# EAGLE design Messgeraet (EAGLE 6.2)
Widerstandsnetzwerk für Messgerät
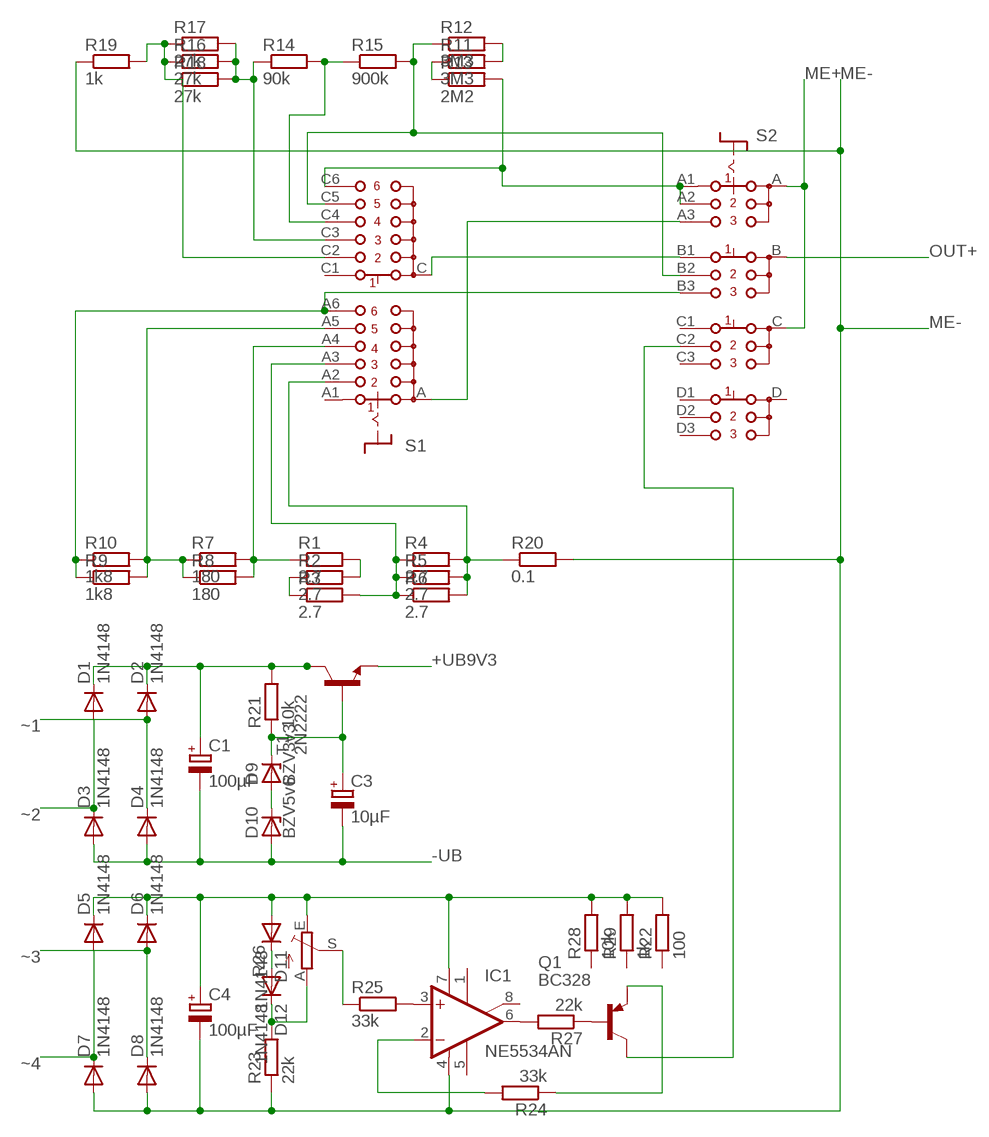
[diagram p0: schematic, sheet 1]

## Parts
C1  100µF  CPOL-EUE5-10.5  [E5-10,5]
C3  10µF  CPOL-EUE5-10.5  [E5-10,5]
C4  100µF  CPOL-EUE5-10.5  [E5-10,5]
D1  1N4148  1N4148DO35-7  [DO35-7]
D2  1N4148  1N4148DO35-7  [DO35-7]
D3  1N4148  1N4148DO35-7  [DO35-7]
D4  1N4148  1N4148DO35-7  [DO35-7]
D5  1N4148  1N4148DO35-7  [DO35-7]
D6  1N4148  1N4148DO35-7  [DO35-7]
D7  1N4148  1N4148DO35-7  [DO35-7]
D8  1N4148  1N4148DO35-7  [DO35-7]
D9  BZV3v3  BZV10  [DO34Z7]
D10  BZV5v6  BZV10  [DO34Z7]
D11  1N4148  1N4148DO35-7  [DO35-7]
D12  1N4148  1N4148DO35-7  [DO35-7]
IC1  NE5534AN  [DIL08]
Q1  BC328  [TO92-EBC]
R1  2.7  R-EU_0617/17  [0617/17]
R2  2.7  R-EU_0617/17  [0617/17]
R3  2.7  R-EU_0617/17  [0617/17]
R4  2.7  R-EU_0617/17  [0617/17]
R5  2.7  R-EU_0617/17  [0617/17]
R6  2.7  R-EU_0617/17  [0617/17]
R7  180  R-EU_0309/12  [0309/12]
R8  180  R-EU_0309/12  [0309/12]
R9  1k8  R-EU_0309/10  [0309/10]
R10  1k8  R-EU_0309/10  [0309/10]
R11  3M3  R-EU_0309/12  [0309/12]
R12  3M3  R-EU_0309/12  [0309/12]
R13  2M2  R-EU_0411/15  [0411/15]
R14  90k  R-EU_0411/15  [0411/15]
R15  900k  R-EU_0309/V  [0309V]
R16  27k  R-EU_0309/12  [0309/12]
R17  27k  R-EU_0309/12  [0309/12]
R18  27k  R-EU_0309/12  [0309/12]
R19  1k  R-EU_0309/10  [0309/10]
R20  0.1  R-EU_VTA52  [VTA52]
R21  10k  R-EU_0309/10  [0309/10]
R22  100  R-EU_0309/10  [0309/10]
R23  22k  R-EU_0309/10  [0309/10]
R24  33k  R-EU_0309/10  [0309/10]
R25  33k  R-EU_0309/10  [0309/10]
R26  TRIM_EU-RJ9W  [RJ9W]
R27  22k  R-EU_0309/10  [0309/10]
R28  10k  R-EU_0309/10  [0309/10]
R29  1k  R-EU_0309/10  [0309/10]
S1  CK102X06  [CK102X06]
S2  CK104X03  [CK104X03]
T1  2N2222  [TO18]

## Nets
+UB9V3: T1.1(E)
-UB: C1.- C3.- D3.A D4.A D10.A
ME+: S2.A S2.C
ME-: C4.- D7.A D8.A IC1.4(V-) R19.1 R20.2 R23.1
N$1: R7.1 R8.1 R9.2 R10.2 S1.A5
N$2: S1.A S2.A3
N$3: R1.1 R7.2 R8.2 S1.A4
N$4: R9.1 R10.1 S1.A6 S2.B3
N$5: R1.2 R2.2
N$6: R2.1 R3.1
N$7: R3.2 R4.1 R5.1 R6.1 S1.A3
N$8: R4.2 R5.2 R6.2 R20.1 S1.A2
N$9: R14.1 R16.2 R17.2 R18.2 S1.C3
N$10: R16.1 R17.1 R18.1 R19.2 S1.C2
N$11: D12.C R23.2 R26.A
N$12: R14.2 R15.1 S1.C4
N$13: R12.1 R15.2 S1.C5 S2.B2
N$14: R11.2 R12.2
N$15: R11.1 R13.1
N$16: R13.2 S1.C6 S2.A1 S2.A2
N$17: S1.C S2.B1
N$18: Q1.C S2.C2
N$19: IC1.6(OUT) R27.2
N$20: C1.+ D1.C D2.C R21.2 T1.3(C)
N$21: Q1.B R27.1
N$22: D11.C D12.A
N$23: Q1.E R24.1
N$25: C4.+ D5.C D6.C D11.A IC1.7(V+) R22.2 R26.E R28.2 R29.2
N$26: R25.1 R26.S
N$27: D9.A D10.C
N$28: C3.+ D9.C R21.1 T1.2(B)
N$29: IC1.2(-IN) R24.2
N$30: IC1.3(+IN) R25.2
OUT+: S2.B
~1: D2.A D4.C
~2: D1.A D3.C
~3: D6.A D8.C
~4: D5.A D7.C
Unconnected: IC1.1(ON) IC1.5(CMP) IC1.8(ON/CMP) R22.1 R28.1 R29.1 S1.A1 S1.C1 S2.C1 S2.C3 S2.D S2.D1 S2.D2 S2.D3

## Library data of the parts
C1 C3 C4 = rcl:CPOL-EU: POLARIZED CAPACITOR, European symbol
D1-D8 D11 D12 = diode:1N4148: DIODE high speed (Philips)
D9 D10 = diode:BZV10: Z DIODE
IC1 = linear:NE5534: LOW-NOISE OPERATIONAL AMPLIFIER Source: http://focus.ti.com/lit/ds/symlink/ne5534.pdf
Q1 = transistor-pnp:BC328*: PNP Transistror
R1-R19 R21-R25 R27-R29 = resistor:R-EU_: RESISTOR, European symbol
R20 = rcl:R-EU_: RESISTOR, European symbol
R26 = pot:TRIM_EU-: POTENTIOMETER
S1 = switch:CK102X06: ROTARY SWITCH C&K
S2 = switch:CK104X03: ROTARY SWITCH C&K
T1 = transistor:2N2222: NPN TRANSISTOR

## Board
Widerstandsnetzwerk für Messgerät
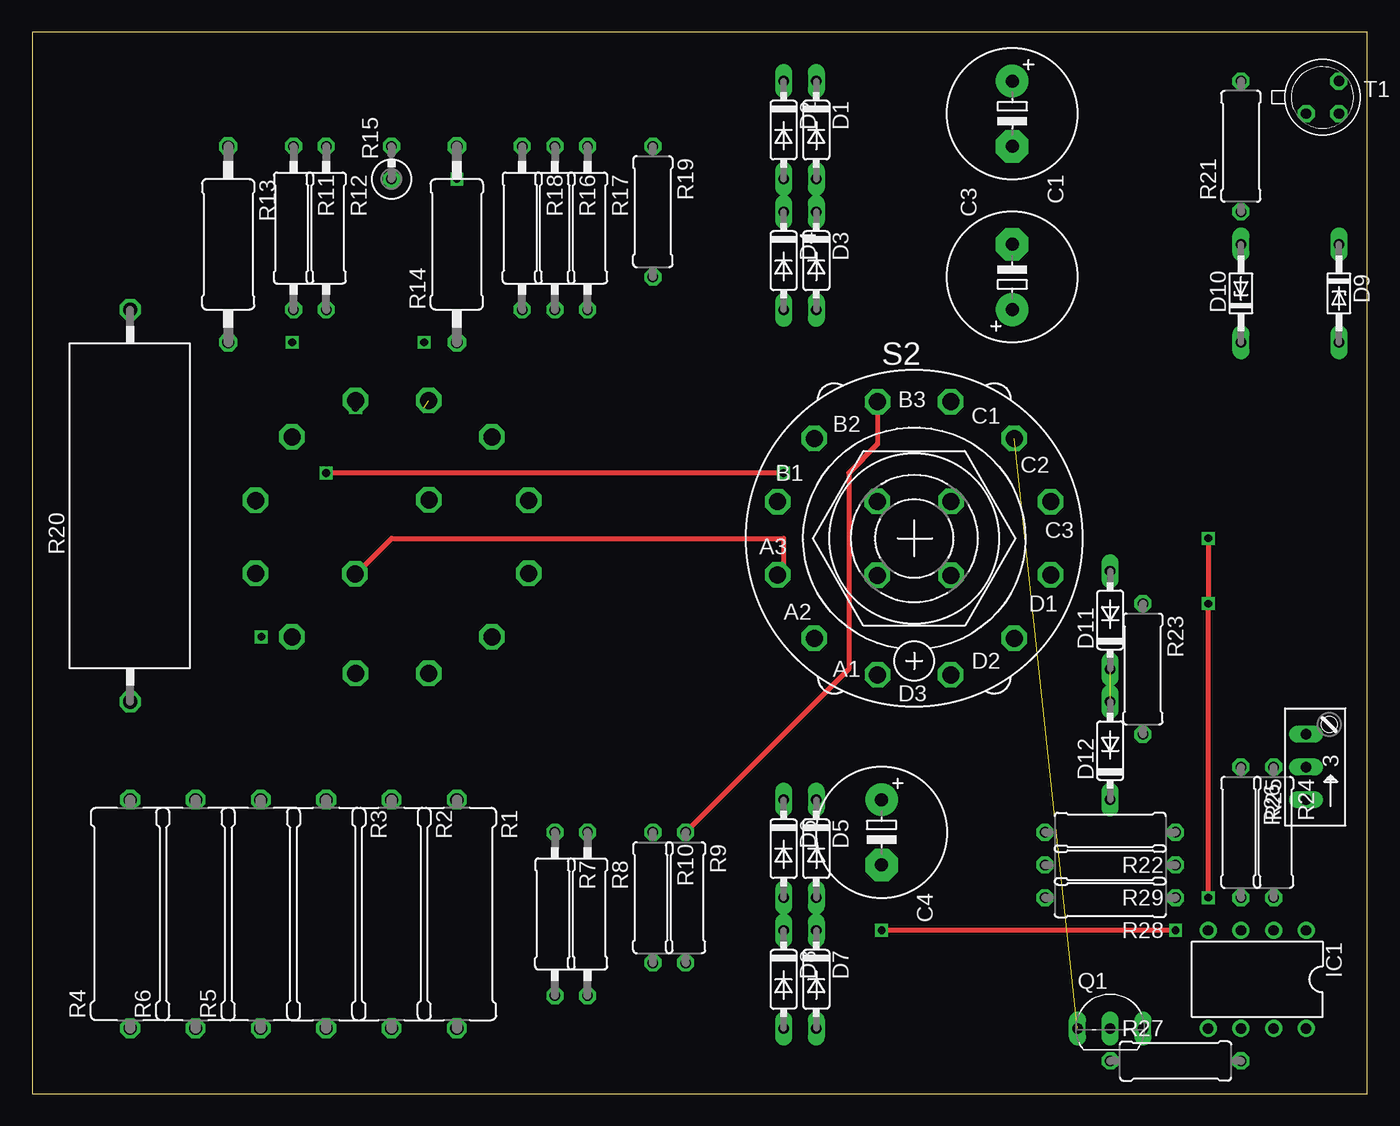
[diagram p1: board, top side]
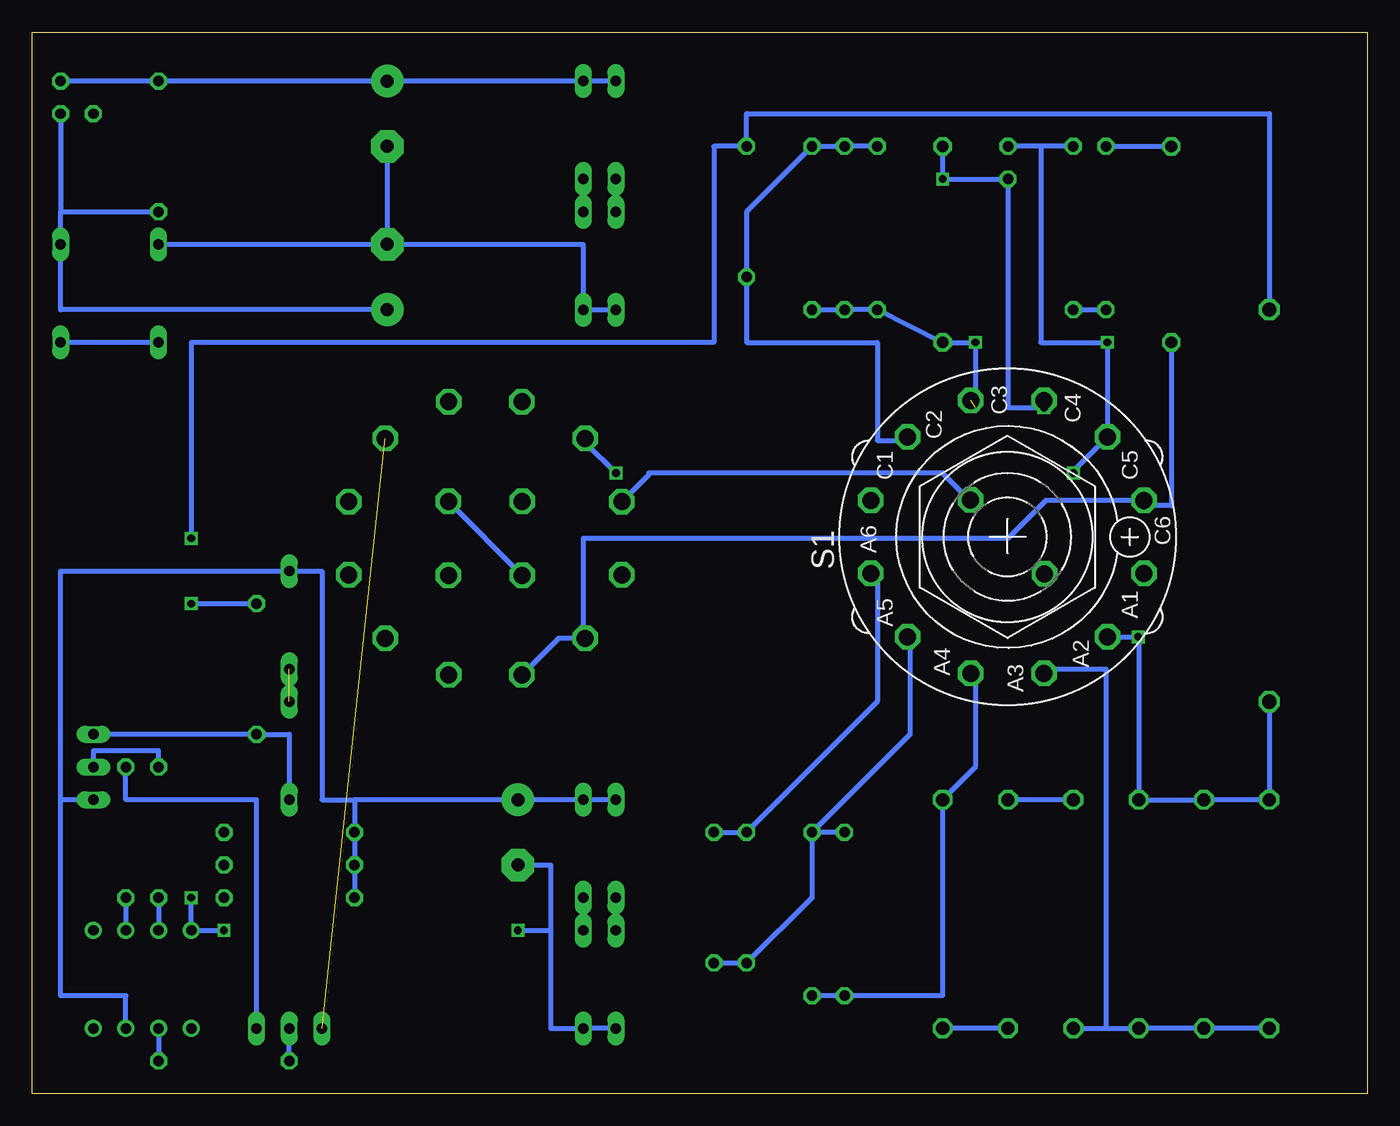
[diagram p2: board, bottom side, seen from below]

Size 103.81 x 82.54 mm. Coordinates in mm from the lower left corner, seen from the top.
Outline: 0,0 103.81,0 103.81,82.54 0,82.54 0,0
Copper layers (1*16): Top 0.035mm / dielectric 1.5mm / Bottom 0.035mm
Design rules: minimum track width 10mil, minimum drill 24mil, track to track 8mil, track to pad 8mil, pad to pad 8mil, via to via 8mil, smd to smd 8mil, copper to edge 40mil, drill to drill 8mil, minimum pad ring 10mil, minimum via ring 8mil, stop-mask expansion 4mil, vias tented up to drill 0mil, thermal gap 10mil

### Footprints (pad centres in the part's own frame; a part is rotated, then mirrored left to right if it is on the bottom)
E5-10,5 = drill 1.016 pad 2.54: + -2.54,0 | drill 1.016 pad 2.54 octagon: - 2.54,0
DO35-7 = drill 0.813 long: A 3.81,0; C -3.81,0
DO34Z7 = drill 0.813 long: A 3.81,0; C -3.81,0
DIL08 = drill 0.813 pad 1.27: 1 -3.81,-3.81; 2 -1.27,-3.81; 3 1.27,-3.81; 4 3.81,-3.81; 5 3.81,3.81; 6 1.27,3.81; 7 -1.27,3.81; 8 -3.81,3.81
TO92-EBC = drill 0.813 long: B 0,-1.27; C -2.54,-1.27; E 2.54,-1.27
0617/17 = drill 1.016 octagon: 1 -8.89,0; 2 8.89,0
0309/12 = drill 0.813 octagon: 1 -6.35,0; 2 6.35,0
0309/10 = drill 0.813 octagon: 1 -5.08,0; 2 5.08,0
0411/15 = drill 0.914 octagon: 1 -7.62,0; 2 7.62,0
0309V = drill 0.813 octagon: 1 -1.27,0; 2 1.27,0
VTA52 = drill 1.1 octagon: 1 -15.24,0; 2 15.24,0
RJ9W = drill 0.813 long: A 2.54,0.635; E -2.54,0.635; S 0,0.635
CK102X06 = drill 1.321 octagon: A -2.87,-2.87; A1 -2.845,-10.617; A2 -7.772,-7.772; A3 -10.617,-2.845; A4 -10.617,2.845; A5 -7.772,7.772; A6 -2.845,10.617; C 2.87,2.87; C1 2.845,10.617; C2 7.772,7.772; C3 10.617,2.845; C4 10.617,-2.845; C5 7.772,-7.772; C6 2.845,-10.617
CK104X03 = drill 1.321 octagon: A -2.87,-2.87; A1 -2.845,-10.617; A2 -7.772,-7.772; A3 -10.617,-2.845; B -2.87,2.87; B1 -10.617,2.845; B2 -7.772,7.772; B3 -2.845,10.617; C 2.87,2.87; C1 2.845,10.617; C2 7.772,7.772; C3 10.617,2.845; D 2.87,-2.87; D1 10.617,-2.845; D2 7.772,-7.772; D3 2.845,-10.617
TO18 = drill 0.813 octagon: 1 -1.27,-1.27; 2 1.27,-1.27; 3 1.27,1.27

### Placement (x,y rotation side)
C1  76.2,76.2 270 top
C3  76.2,63.5 90 top
C4  66.04,20.32 270 top
D1  60.96,74.93 270 top
D2  58.42,74.93 270 top
D3  60.96,64.77 270 top
D4  58.42,64.77 270 top
D5  60.96,19.05 270 top
D6  58.42,19.05 270 top
D7  60.96,8.89 270 top
D8  58.42,8.89 270 top
D9  101.6,62.23 270 top
D10  93.98,62.23 90 top
D11  83.82,36.83 90 top
D12  83.82,26.67 90 top
IC1  95.25,8.89 180 top
Q1  83.82,6.35 0 top
R1  33.02,13.97 270 top
R2  27.94,13.97 270 top
R3  22.86,13.97 270 top
R4  7.62,13.97 90 top
R5  17.78,13.97 90 top
R6  12.7,13.97 90 top
R7  40.64,13.97 270 top
R8  43.18,13.97 270 top
R9  50.8,15.24 270 top
R10  48.26,15.24 270 top
R11  20.32,67.31 270 top
R12  22.86,67.31 270 top
R13  15.24,66.04 270 top
R14  33.02,66.04 90 top
R15  27.94,72.39 90 top
R16  40.64,67.31 270 top
R17  43.18,67.31 270 top
R18  38.1,67.31 270 top
R19  48.26,68.58 270 top
R20  7.62,45.72 90 top
R21  93.98,73.66 90 top
R22  83.82,20.32 180 top
R23  86.36,33.02 270 top
R24  96.52,20.32 270 top
R25  93.98,20.32 270 top
R26  99.7,25.4 90 top
R27  88.9,2.54 0 top
R28  83.82,15.24 180 top
R29  83.82,17.78 180 top
S1  27.98,43.29 90 bottom
S2  68.58,43.18 0 top
T1  100.33,77.47 0 top

### Tracks (layer width: path | path; a pad name or v marks a point on that pad's centre or on a via)
-UB
  Bottom 0.406: D10.A C3.- | C1.- C3.- | C3.- 60.96,66.04 D3.A D4.A
ME+
  Bottom 0.406: S2.C S2.A
ME-  (via drill 0.6)
  Top 0.406: v91.44,15.24 v91.44,38.1 v91.44,43.18 | v88.9,12.7 v66.04,12.7
  Bottom 0.406: R20.2 7.62,76.2 48.26,76.2 R19.1 50.8,73.66 50.8,58.42 91.44,58.42 v91.44,43.18 | D8.A D7.A 63.5,5.08 63.5,12.7 | C4.- 63.5,17.78 63.5,12.7 | v91.44,15.24 IC1.4 v88.9,12.7 | v91.44,38.1 R23.1 | v66.04,12.7 63.5,12.7
N$1  (via drill 0.6)
  Bottom 0.406: R7.1 R8.1 | R9.2 R10.2 43.18,15.24 R8.1 | S1.A5 v35.6,35.52 35.56,35.56 35.56,27.94 R8.1
N$2
  Top 0.406: S1.A 25.18,40.42 27.94,43.18 58.42,43.18 58.42,40.79 S2.A3
N$3  (via drill 0.6)
  Bottom 0.406: R8.2 R7.2 33.02,7.62 R1.1 30.48,25.4 30.48,33.02 S1.A4
  other vias: 30.82,32.68
N$4  (via drill 0.6)
  Top 0.406: S2.B3 65.73,50.49 63.5,48.26 63.5,33.02 R9.1
  Bottom 0.406: R9.1 R10.1 38.1,30.48 38.1,40.64 v38.29,40.45 S1.A6
N$5
  Bottom 0.406: R2.2 R1.2
N$6
  Bottom 0.406: R3.1 R2.1
N$7  (via drill 0.6)
  Bottom 0.406: R4.1 R6.1 R5.1 20.32,5.08 | R3.2 20.32,5.08 | S1.A3 v25.13,32.76 25.4,33.02 20.32,33.02 20.32,5.08
N$8  (via drill 0.6)
  Bottom 0.406: R20.1 R4.2 R6.2 R5.2 17.78,35.56 v17.82,35.52 S1.A2
N$9  (via drill 0.6)  (1 unrouted)
  Bottom 0.406: R17.2 R16.2 R18.2 R14.1 v30.48,58.42 30.48,53.34
N$10  (via drill 0.6)
  Bottom 0.406: R18.1 R16.1 R17.1 48.26,68.58 R19.2 48.26,58.42 38.1,58.42 38.1,50.8 v35.75,50.8 S1.C2
N$11
  Bottom 0.406: D12.C 83.82,27.94 R23.2 R26.A
N$12  (via drill 0.6)
  Bottom 0.406: S1.C4 v25.13,53.34 27.94,53.34 R15.1 v33.02,71.12 R14.2
N$13  (via drill 0.6)
  Top 0.406: v58.42,48.26 v22.86,48.26
  Bottom 0.406: R15.2 R12.1 25.4,73.66 25.4,58.42 v20.21,58.42 S1.C5 22.86,48.41 v22.86,48.26 | S2.B2 60.81,50.65 v58.42,48.26
N$14
  Bottom 0.406: R12.2 R11.2
N$15
  Bottom 0.406: R11.1 R13.1
N$16  (via drill 0.6)
  Bottom 0.406: R13.2 15.24,45.72 v17.36,45.72 S1.C6 24.98,46.14 27.94,43.18 60.96,43.18 60.96,35.56 S2.A2 62.89,35.41 S2.A1
N$17
  Bottom 0.406: S1.C 30.93,46.16 33.02,48.26 55.88,48.26 55.88,48.11 S2.B1
N$18  (1 unrouted)
N$19
  Bottom 0.406: IC1.6 R27.2
N$20
  Bottom 0.406: D2.C D1.C C1.+ R21.2 T1.3
N$21
  Bottom 0.406: R27.1 Q1.B
N$22  (1 unrouted)
N$23
  Bottom 0.406: Q1.E 86.36,22.86 96.52,22.86 R24.1
N$25
  Bottom 0.406: D5.C D6.C C4.+ 78.74,22.86 | 78.74,22.86 R22.2 R29.2 R28.2 | 78.74,22.86 81.28,22.86 81.28,40.64 D11.A 101.6,40.64 101.6,22.86 | R26.E 101.6,22.86 | IC1.7 96.52,7.62 101.6,7.62 101.6,22.86
N$26
  Bottom 0.406: R25.1 93.98,26.67 99.06,26.67 R26.S
N$27
  Bottom 0.406: D10.C D9.A
N$28
  Bottom 0.406: T1.2 101.6,68.58 | 101.6,68.58 D9.C 101.6,60.96 C3.+ | 101.6,68.58 R21.1
N$29
  Bottom 0.406: R24.2 IC1.2
N$30
  Bottom 0.406: R25.2 IC1.3
N$31  (via drill 0.6)
  other vias: 91.44,15.24
~1
  Bottom 0.406: D2.A D4.C
~2
  Bottom 0.406: D1.A D3.C
~3
  Bottom 0.406: D6.A D8.C
~4
  Bottom 0.406: D5.A D7.C